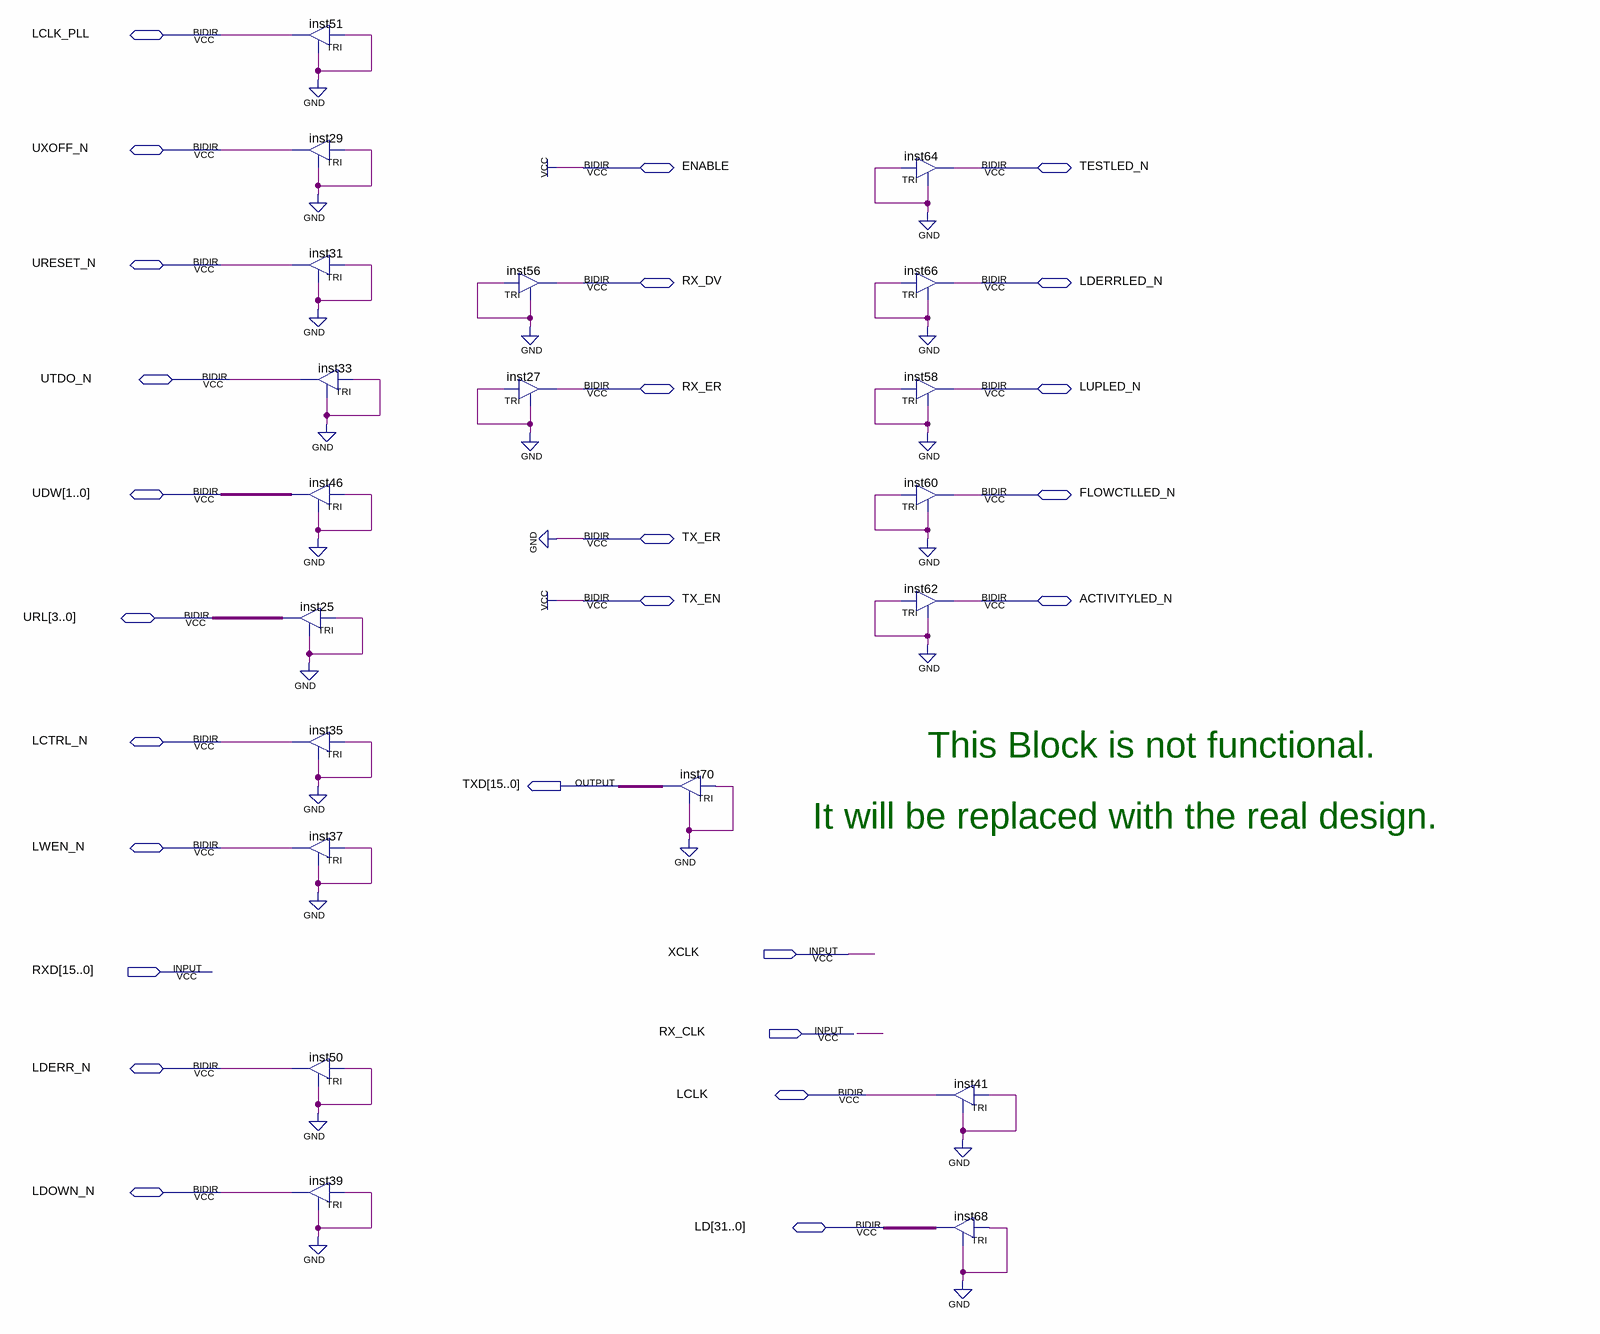
[diagram p0: schematic sheet]
// Quartus schematic glink_interface.bdf as structural Verilog: 20 symbols, 26 pins
module glink_interface (
  input  XCLK,
  input  [15:0] RXD,
  input  RX_CLK,
  inout  LCLK_PLL,
  inout  UXOFF_N,
  inout  ENABLE,
  inout  TESTLED_N,
  inout  URESET_N,
  inout  RX_DV,
  inout  LDERRLED_N,
  inout  UTDO_N,
  inout  RX_ER,
  inout  LUPLED_N,
  inout  [1:0] UDW,
  inout  FLOWCTLLED_N,
  inout  TX_ER,
  inout  TX_EN,
  inout  ACTIVITYLED_N,
  inout  [3:0] URL,
  inout  LCTRL_N,
  inout  LWEN_N,
  inout  LDERR_N,
  inout  LCLK,
  inout  LDOWN_N,
  inout  [31:0] LD,
  output [15:0] TXD
);

  TRI inst51 (.IN(1'b0), .OE(1'b0), .OUT(LCLK_PLL));
  TRI inst29 (.IN(1'b0), .OE(1'b0), .OUT(UXOFF_N));
  TRI inst31 (.IN(1'b0), .OE(1'b0), .OUT(URESET_N));
  TRI inst33 (.IN(1'b0), .OE(1'b0), .OUT(UTDO_N));
  TRI inst46[1:0] (.IN(1'b0), .OE(1'b0), .OUT(UDW));
  TRI inst25[3:0] (.IN(1'b0), .OE(1'b0), .OUT(URL));
  TRI inst35 (.IN(1'b0), .OE(1'b0), .OUT(LCTRL_N));
  TRI inst37 (.IN(1'b0), .OE(1'b0), .OUT(LWEN_N));
  TRI inst50 (.IN(1'b0), .OE(1'b0), .OUT(LDERR_N));
  TRI inst39 (.IN(1'b0), .OE(1'b0), .OUT(LDOWN_N));
  TRI inst56 (.IN(1'b0), .OE(1'b0), .OUT(RX_DV));
  TRI inst27 (.IN(1'b0), .OE(1'b0), .OUT(RX_ER));
  TRI inst70[15:0] (.IN(1'b0), .OE(1'b0), .OUT(TXD));
  TRI inst64 (.IN(1'b0), .OE(1'b0), .OUT(TESTLED_N));
  TRI inst66 (.IN(1'b0), .OE(1'b0), .OUT(LDERRLED_N));
  TRI inst58 (.IN(1'b0), .OE(1'b0), .OUT(LUPLED_N));
  TRI inst60 (.IN(1'b0), .OE(1'b0), .OUT(FLOWCTLLED_N));
  TRI inst62 (.IN(1'b0), .OE(1'b0), .OUT(ACTIVITYLED_N));
  TRI inst41 (.IN(1'b0), .OE(1'b0), .OUT(LCLK));
  TRI inst68[31:0] (.IN(1'b0), .OE(1'b0), .OUT(LD));
  // also tied to GND on the sheet: TX_ER
  // also tied to VCC on the sheet: {ENABLE, TX_EN}

  // Notes on the sheet:
  //   This Block is not functional.
  //   It will be replaced with the real design.
endmodule
